# EAGLE design usb-sanitizer (EAGLE 7.2.0)
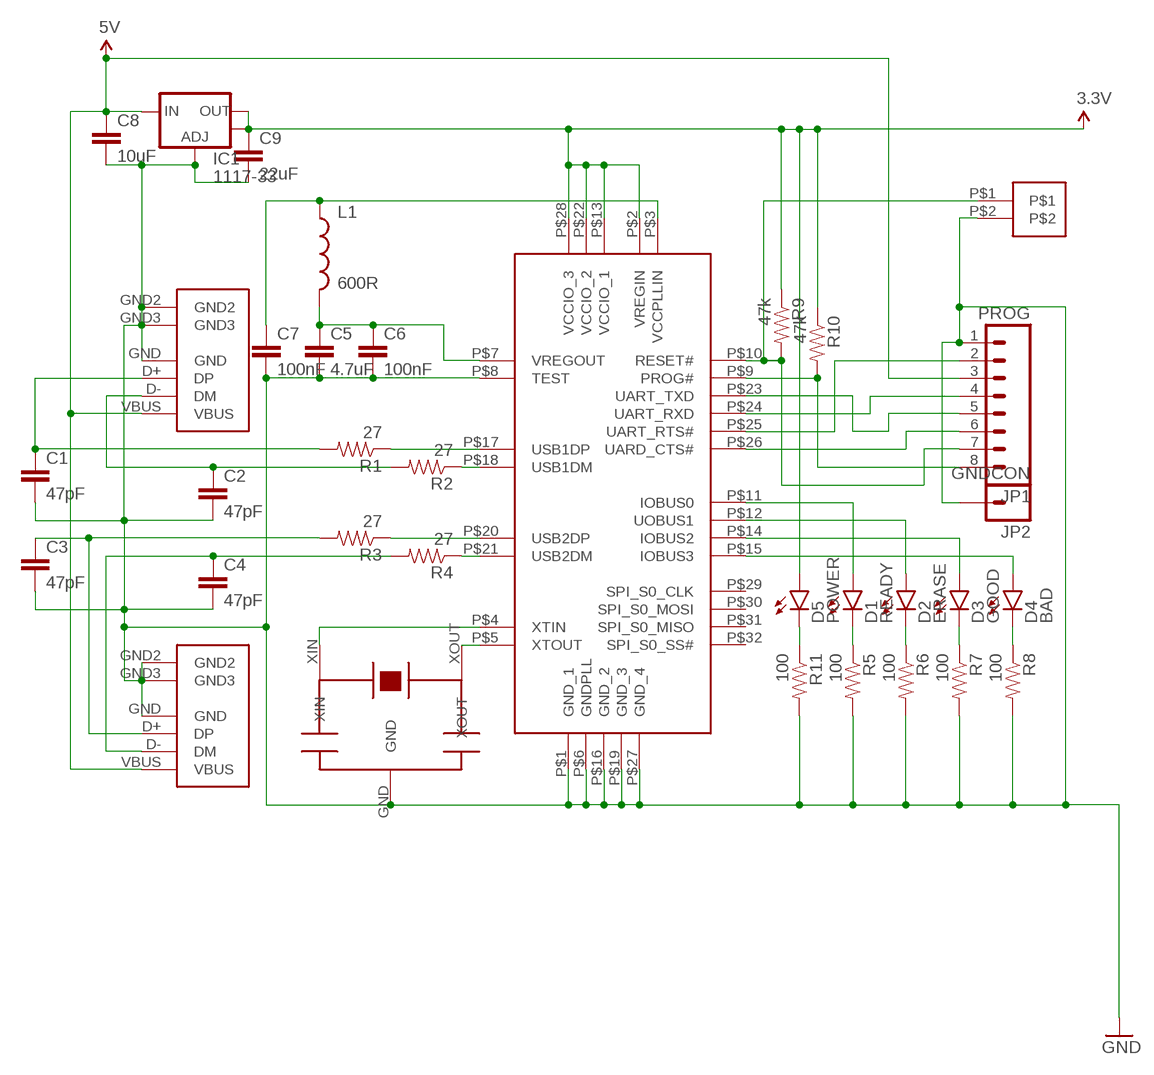
[diagram p0: schematic, sheet 1]

## Parts
C1  47pF  CAP0805  [0805]
C2  47pF  CAP0805  [0805]
C3  47pF  CAP0805  [0805]
C4  47pF  CAP0805  [0805]
C5  4.7uF  CAP0805  [0805]
C6  100nF  CAP0805  [0805]
C7  100nF  CAP0805  [0805]
C8  10uF  CAP0805  [0805]
C9  22uF  CAP0805  [0805]
D1  READY  LED-0805  [0805]
D2  ERASE  LED-0805  [0805]
D3  GOOD  LED-0805  [0805]
D4  BAD  LED-0805  [0805]
D5  POWER  LED-0805  [0805]
IC1  1117-33  V_REG_LM1117SOT223  [SOT223]
JP1  PROG  M08LOCK  [1X08_LOCK]
JP2  GNDCON  M01PTH  [1X01]
L1  600R  INDUCTOR0805  [0805]
R1  27  RESISTOR0805-RES  [0805]
R2  27  RESISTOR0805-RES  [0805]
R3  27  RESISTOR0805-RES  [0805]
R4  27  RESISTOR0805-RES  [0805]
R5  100  RESISTOR0805-RES  [0805]
R6  100  RESISTOR0805-RES  [0805]
R7  100  RESISTOR0805-RES  [0805]
R8  100  RESISTOR0805-RES  [0805]
R9  47k  RESISTOR0805-RES  [0805]
R10  47k  RESISTOR0805-RES  [0805]
R11  100  RESISTOR0805-RES  [0805]
U$1  VNC2  [QFP32]
U$4  RESONATOR  [RESONATOR]
U$5  SWITCH  [SWITCH]
USB_FEMALE  USB_AF  [USB-A-F]
USB_MALE  USB_AM  [USB-A-M]

## Nets
3.3V: C9.1 D5.1(A) IC1.2(OUT) IC1.4(OUT) R9.1 R10.1 U$1.P$2(VREGIN) U$1.P$13(VCCIO_1) U$1.P$22(VCCIO_2) U$1.P$28(VCCIO_3)
5V: C8.1 IC1.3(IN) JP1.3 USB_FEMALE.VBUS USB_MALE.VBUS
GND: C1.2 C2.2 C3.2 C4.2 C5.2 C6.2 C7.2 C8.2 C9.2 IC1.1(ADJ) JP1.1 JP2.1 R5.2 R6.2 R7.2 R8.2 R11.2 U$1.P$1(GND_1) U$1.P$6(GNDPLL) U$1.P$8(TEST) U$1.P$16(GND_2) U$1.P$19(GND_3) U$1.P$27(GND_4) U$4.GND U$5.P$2 USB_FEMALE.GND USB_FEMALE.GND2 USB_FEMALE.GND3 USB_MALE.GND USB_MALE.GND2 USB_MALE.GND3
N$9: D5.2(C) R11.1
N$10: C5.1 C6.1 L1.2 U$1.P$7(VREGOUT)
N$11: C7.1 L1.1 U$1.P$3(VCCPLLIN)
N$13: U$1.P$5(XTOUT) U$4.XOUT
N$14: U$1.P$4(XTIN) U$4.XIN
N$15: JP1.2 U$1.P$25(UART_RTS#)
N$16: JP1.4 U$1.P$24(UART_RXD)
N$17: JP1.5 U$1.P$23(UART_TXD)
N$18: JP1.6 U$1.P$26(UARD_CTS#)
N$20: JP1.8 R10.2 U$1.P$9(PROG#)
N$21: JP1.7 R9.2 U$1.P$10(RESET#) U$5.P$1
N$22: D1.2(C) R5.1
N$23: D2.2(C) R6.1
N$24: D4.2(C) R8.1
N$25: D3.2(C) R7.1
N$26: D1.1(A) U$1.P$11(IOBUS0)
N$27: D2.1(A) U$1.P$12(UOBUS1)
N$28: D3.1(A) U$1.P$14(IOBUS2)
N$29: D4.1(A) U$1.P$15(IOBUS3)
USB1DM: R2.1 U$1.P$18(USB1DM)
USB1DP: R1.1 U$1.P$17(USB1DP)
USB1RDM: C2.1 R2.2 USB_FEMALE.D-(DM)
USB1RDP: C1.1 R1.2 USB_FEMALE.D+(DP)
USB2DM: R4.1 U$1.P$21(USB2DM)
USB2DP: R3.1 U$1.P$20(USB2DP)
USB2RDM: C4.1 R4.2 USB_MALE.D-(DM)
USB2RDP: C3.1 R3.2 USB_MALE.D+(DP)
Unconnected: U$1.P$29(SPI_S0_CLK) U$1.P$30(SPI_S0_MOSI) U$1.P$31(SPI_S0_MISO) U$1.P$32(SPI_S0_SS#)

## Library data of the parts
C1-C9 = SparkFun-Passives:CAP: Capacitor Standard 0603 ceramic capacitor, and 0.1" leaded capacitor.
D1-D5 = vinivulum:LED-0805
IC1 = SparkFun-PowerIC:V_REG_LM1117: Voltage Regulator LM1117 Standard adjustable voltage regulator but in SMD form. Spark Fun Electronics SKU : COM-00595; PROD_ID: VREG-08170
JP1 = SparkFun-Connectors:M08: Header 8 Standard 8-pin 0.1" header. Use with straight break away headers (SKU : PRT-00116), right angle break away headers (PRT-00553), swiss pins (PRT-00743), machine pins (PRT-00117), and female headers (PRT-00115).
JP2 = SparkFun-Connectors:M01: Header 1 Standard 1-pin 0.1" header. Use with straight break away headers (SKU : PRT-00116), right angle break away headers (PRT-00553), swiss pins (PRT-00743), machine pins (PRT-00117), and female headers (PRT-00115).
L1 = SparkFun-Passives:INDUCTOR: Inductors Basic Inductor/Choke - 0603 and 1206. Footprints are not proven and vary greatly between part numbers. SRN6045- 33uH, 20% 1.4A SDR0403-560KL - 56uH, 10%, 500mA RMS/740mA peak
R1-R11 = SparkFun-Passives:RESISTOR: Resistor Basic schematic elements and footprints for 0603, 1206, and PTH resistors.
U$1 = vinivulum:VNC2
U$4 = vinivulum:RESONATOR
U$5 = vinivulum:SWITCH
USB_FEMALE USB_MALE = vinivulum:USB_A

## Board
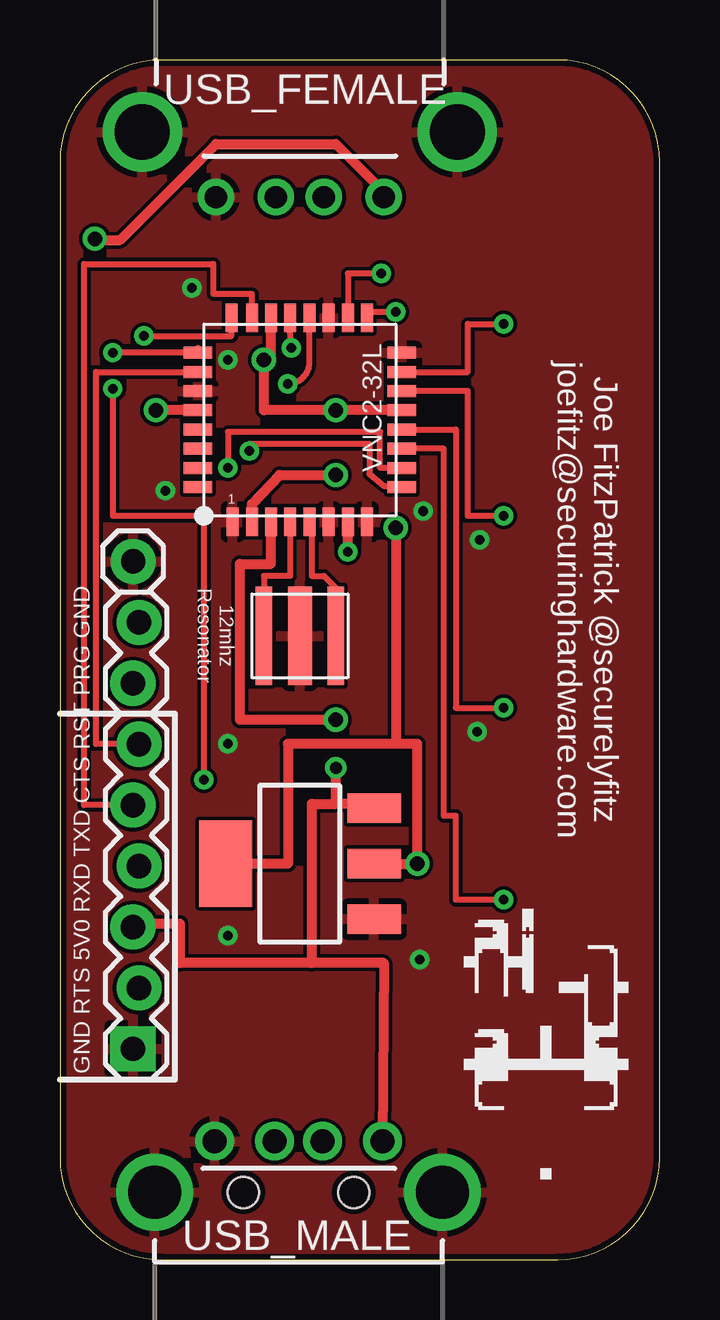
[diagram p1: board, top side]
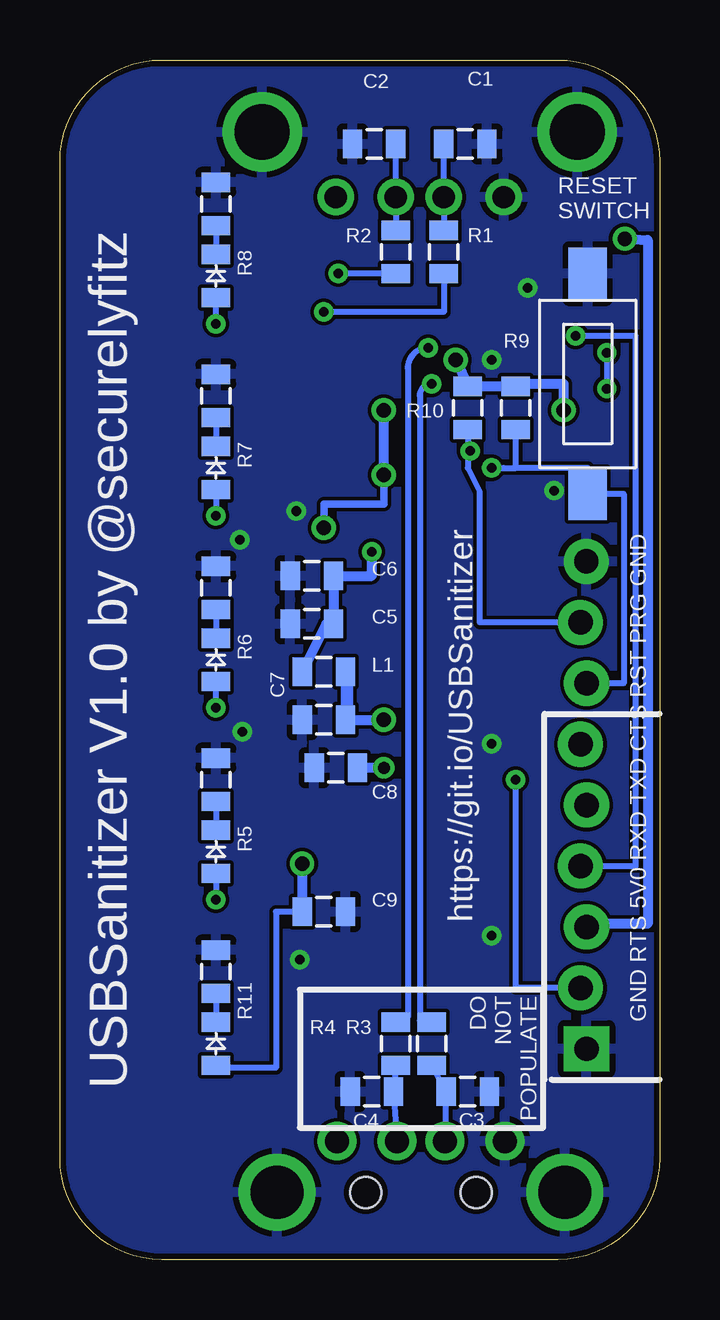
[diagram p2: board, bottom side, seen from below]

Size 25 x 50 mm. Coordinates in mm from the lower left corner, seen from the top.
Outline: 0,45.76 0,4.24 arc90 4.24,0 20.76,0 arc90 25,4.24 25,45.76 arc90 20.76,50 4.24,50 arc90 0,45.76
Copper layers (1*16): Top 0.035mm / dielectric 1.5mm / Bottom 0.035mm
Design rules "DFRobot_Eagle_Rule_v0.4 *": minimum track width 6mil, minimum drill 12mil, track to track 6mil, track to pad 6mil, pad to pad 6mil, via to via 6mil, smd to smd 0mil, copper to edge 10mil, drill to drill 10mil, minimum pad ring 12mil, minimum via ring 8mil, stop-mask expansion 2mil, vias tented up to drill 25mil, thermal gap 10mil

### Footprints (pad centres in the part's own frame; a part is rotated, then mirrored left to right if it is on the bottom)
0805 = smd 0.8 x 1.2: 1 -0.9,0; 2 0.9,0
SOT223 = smd 1.219 x 2.235: 1 -2.311,-3.099; 2 0,-3.099; 3 2.311,-3.099 | smd 3.6 x 2.2: 4 0,3.099
1X08_LOCK = drill 1.016 pad 1.88 square: 1 0,0.127 | drill 1.016 pad 1.88: 2 2.54,-0.127; 3 5.08,0.127; 4 7.62,-0.127; 5 10.16,0.127; 6 12.7,-0.127; 7 15.24,0.127; 8 17.78,-0.127
1X01 = drill 1.016 pad 1.88: 1 0,0
QFP32 = smd 0.5 x 1.2: P$1 -2.8,-4.25; P$2 -2,-4.25; P$3 -1.2,-4.25; P$4 -0.4,-4.25; P$5 0.4,-4.25; P$6 1.2,-4.25; P$7 2,-4.25; P$8 2.8,-4.25; P$17 2.8,4.25; P$18 2,4.25; P$19 1.2,4.25; P$20 0.4,4.25; P$21 -0.4,4.25; P$22 -1.2,4.25; P$23 -2,4.25; P$24 -2.85,4.25 | smd 1.2 x 0.5: P$9 4.25,-2.8; P$10 4.25,-2; P$11 4.25,-1.2; P$12 4.25,-0.4; P$13 4.25,0.4; P$14 4.25,1.2; P$15 4.25,2; P$16 4.25,2.8; P$25 -4.25,2.8; P$26 -4.25,2; P$27 -4.25,1.2; P$28 -4.25,0.4; P$29 -4.25,-0.4; P$30 -4.25,-1.2; P$31 -4.25,-2; P$32 -4.25,-2.8
RESONATOR = smd 1 x 4.1: GND 0,0 | smd 0.7 x 4.1: XIN -1.5,0; XOUT 1.5,0
SWITCH = smd 2.18 x 1.6: P$1 -4.59,0; P$2 4.59,0
USB-A-F = drill 0.92: D+ 2.71,-1; D- 2.71,1; GND 2.71,-3.5; VBUS 2.71,3.5 | drill 2.3: GND2 0,-6.57; GND3 0,6.57
USB-A-M = drill 1: D+ 2.13,1; D- 2.13,-1; GND 2.13,3.5; VBUS 2.13,-3.5 | drill 2.2: GND2 0,-6; GND3 0,6 | hole 1.3: 0,2.3; 0,-2.3

### Placement (x,y rotation side)
C1  8.1,46.5 0 bottom
C2  11.9,46.5 180 bottom
C3  8,7 0 bottom
C4  12,7 180 bottom
C5  14.5,26.5 180 bottom
C6  14.5,28.5 180 bottom
C7  14,22.5 180 bottom
C8  13.5,20.5 180 bottom
C9  14,14.5 0 bottom
D1  18.5,17 90 bottom
D2  18.5,25 90 bottom
D3  18.5,33 90 bottom
D4  18.5,41 90 bottom
D5  18.5,9 90 bottom
IC1  10,16.5 90 top
JP1  3.17,8.78 90 top
JP2  3.05,29.1 0 top
L1  14,24.5 180 bottom
R1  9,42 90 bottom
R2  11,42 90 bottom
R3  9.5,9 270 bottom
R4  11,9 270 bottom
R5  18.5,20 90 bottom
R6  18.5,28 90 bottom
R7  18.5,36 90 bottom
R8  18.5,44 90 bottom
R9  6,35.5 270 bottom
R10  8,35.5 270 bottom
R11  18.5,12 90 bottom
U$1  10,35 0 top
U$2  [SH-HALFINCH]  16,15 270 top
U$3  [OSHW]  18.5,47 270 top
U$4  10,26 0 top
U$5  3,36.5 90 bottom
USB_FEMALE  10,47 270 top
USB_MALE  9.95,2.8 90 top

### Tracks (layer width: path | path; a pad name or v marks a point on that pad's centre or on a via)
3.3V  (via drill 0.6)
  Top 0.406: U$1.P$13 v11.5,35.4 8.5,35.4 v8.5,37.5 8.8,37.5 U$1.P$22 | U$1.P$28 v4,35.4 | v14,30.5 14,21.5 | 14,21.5 9.5,21.5 9.5,16.5 IC1.4 | IC1.2 v14.9,16.5 14.9,21.5 14,21.5 | U$1.P$2 8,31.5 9.15,32.7 v11.5,32.7
  Bottom 0.254: C9.1 16,14.5 16,8 18.5,8 D5.1
  Bottom 0.305: v14,30.5 14,31.5 11.5,31.5 v11.5,32.7
  Bottom 0.406: v14.9,16.5 C9.1 | v8.5,37.5 R10.1 R9.1 6,36.5 4,36.5 v4,35.4 | v11.5,32.7 v11.5,35.4
5V  (via drill 0.5, 0.6)
  Top 0.406: USB_MALE.VBUS 13.5,12.36 10.5,12.36 | 10.5,12.36 10.5,19 11.5,19 | IC1.3 12.6,19 11.5,19 | 11.5,19 v11.5,20.5 | 10.5,12.36 5,12.36 5,14 3.04,14 JP1.3 | v1.45,42.55 1.5,42.5 2.5,42.5 6.5,46.5 11.5,46.5 13.5,44.5 USB_FEMALE.VBUS
  Bottom 0.406: v11.5,20.5 C8.1 | JP1.3 3.04,14 0.5,14 0.5,42.5 v1.45,42.55
GND  (via drill 0.4)
  other vias: 17.5,30 17.4,22 5.5,40.5 7,21.5 7,13.5 15.15,31.2 7,37.5 15,12.5 4.4,32.05
  pour Bottom: 0,0 25,0 25,50 0,50
  pour Top: 0,0 25,0 25,50 0,50
N$9
  Bottom 0.254: R11.1 D5.2
N$10  (via drill 0.4)
  Top 0.406: v12,29.5 U$1.P$7
  Bottom 0.406: L1.2 13.9,26.5 C5.1 C6.1 12,28.5 v12,29.5
N$11  (via drill 0.6)
  Top 0.406: v11.5,22.5 7.5,22.5 7.5,29 8.8,29 U$1.P$3
  Bottom 0.406: C7.1 L1.1 13,24.5 13,22.5 v11.5,22.5
N$13
  Top 0.254: U$1.P$5 10.5,30.75 10.5,28.5 11,28.5 11.5,28 U$4.XOUT
N$14
  Top 0.254: U$1.P$4 9.6,28.5 8.5,28.5 U$4.XIN
N$15  (via drill 0.4)
  Top 0.254: 5.75,38 U$1.P$25 v2.2,37.8 | v6,20 6,31 2.2,31 v2.2,36.3
  Bottom 0.254: JP1.2 6,11.32 v6,20 | v2.2,37.8 v2.2,36.3
N$16  (via drill 0.4)
  Top 0.254: v3.5,38.5 7.15,38.5 U$1.P$24
  Bottom 0.254: JP1.4 1,16.4 1,38.5 v3.5,38.5
N$17
  Top 0.254: JP1.5 1,18.94 1,41.5 6.4,41.5 6.4,40.25 8,40.25 U$1.P$23
N$18
  Top 0.254: JP1.6 1.5,21.48 1.5,37 U$1.P$26
N$20  (via drill 0.4)
  Top 0.254: v7.9,33.7 7.9,34 12.9,34 12.9,32.75 13.5,32.25 14.2,32.25 U$1.P$9
  Bottom 0.254: R10.2 8,33.8 v7.9,33.7 8,33.7 8,33 7.5,32 7.5,26.56 JP1.8
N$21  (via drill 0.4)
  Top 0.254: U$1.P$10 13.35,33 13.35,34.5 7,34.5 v7,33
  Bottom 0.254: v7,33 6.5,33 6,33 | 6,33 R9.2 | JP1.7 1.5,24.02 1.5,31.91 U$5.P$1 3,33 6,33
N$22
  Bottom 0.254: R5.1 D1.2
N$23
  Bottom 0.254: R6.1 D2.2
N$24
  Bottom 0.254: R8.1 D4.2
N$25
  Bottom 0.254: R7.1 D3.2
N$26  (via drill 0.4)
  Top 0.254: U$1.P$11 16,33.8 16,19 16,18.5 16.5,18.5 16.5,15 v18.5,15
  Bottom 0.254: D1.1 v18.5,15
N$27  (via drill 0.4)
  Top 0.254: U$1.P$12 16.5,34.6 16.5,23 v18.5,23
  Bottom 0.254: v18.5,23 D2.1
N$28  (via drill 0.4)
  Top 0.254: v18.5,31 17,31 17,36.2 U$1.P$14
  Bottom 0.254: D3.1 v18.5,31
N$29  (via drill 0.4)
  Top 0.254: U$1.P$15 17,37 17,39 v18.5,39
  Bottom 0.254: v18.5,39 D4.1
USB1DM  (via drill 0.4)
  Top 0.254: v13.4,41.1 12,41.1 U$1.P$18
  Bottom 0.254: R2.1 v13.4,41.1
USB1DP  (via drill 0.4)
  Top 0.254: v14,39.5 12.8,39.5 U$1.P$17
  Bottom 0.254: R1.1 9,39.5 v14,39.5
USB1RDM
  Bottom 0.254: C2.1 USB_FEMALE.D- R2.2
USB1RDP
  Bottom 0.254: C1.1 USB_FEMALE.D+ R1.2
USB2DM  (via drill 0.4)
  Top 0.254: U$1.P$21 arc90 9.5,39.15 v9.65,38
  Bottom 0.254: v9.65,38 arc-90 10.5,37.15 10.5,10.1 R4.1
USB2DP  (via drill 0.4)
  Top 0.254: v9.5,36.5 arc90 10.4,37.4 U$1.P$20
  Bottom 0.254: v9.5,36.5 arc-90 10,36 10,9.95 R3.1
USB2RDM
  Bottom 0.254: R4.2 C4.1 USB_MALE.D-
USB2RDP
  Bottom 0.254: USB_MALE.D+ 8.9,4.93 C3.1 R3.2

### Text on the board
tNames: VNC2-32L | 1 | Joe FitzPatrick @securelyfitz / joefitz@securinghardware.com | 12mhz / Resonator | GND RTS 5V0 RXD TXD CTS RST PRG GND
bNames: RESET / SWITCH | GND RTS 5V0 RXD TXD CTS RST PRG GND | USBSanitizer V1.0 by @securelyfitz | https://git.io/USBSanitizer | DO / NOT / POPULATE